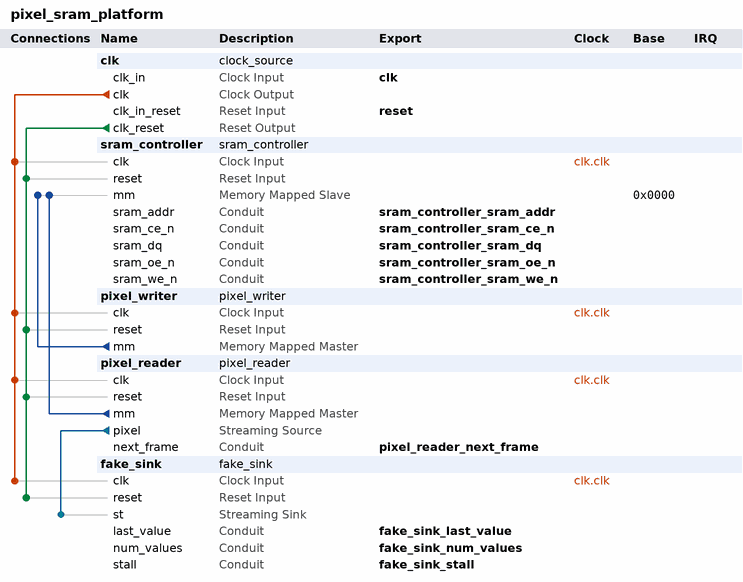
[diagram p0: system contents]
# Platform Designer (Qsys) system pixel_sram_platform, Cyclone IV E EP4CE115F29C7
# Parameters at their usual value, and those the tool derives, are not listed.
package require -exact qsys 21.1
create_system pixel_sram_platform
set_project_property DEVICE_FAMILY {Cyclone IV E}
set_project_property DEVICE EP4CE115F29C7

add_instance clk clock_source 21.1
set_instance_parameter_value clk clockFrequency 50000000

add_instance sram_controller sram_controller 21.1

add_instance pixel_writer pixel_writer 21.1

add_instance pixel_reader pixel_reader 21.1

add_instance fake_sink fake_sink 21.1
set_instance_parameter_value fake_sink COUNTER_WIDTH 8
set_instance_parameter_value fake_sink DATA_WIDTH 24

# connections
add_connection clk.clk fake_sink.clk clock
add_connection clk.clk pixel_reader.clk clock
add_connection clk.clk pixel_writer.clk clock
add_connection clk.clk sram_controller.clk clock
add_connection clk.clk_reset fake_sink.reset reset
add_connection clk.clk_reset pixel_reader.reset reset
add_connection clk.clk_reset pixel_writer.reset reset
add_connection clk.clk_reset sram_controller.reset reset
add_connection pixel_reader.mm sram_controller.mm avalon
set_connection_parameter_value pixel_reader.mm/sram_controller.mm arbitrationPriority 10
set_connection_parameter_value pixel_reader.mm/sram_controller.mm baseAddress 0x0000
add_connection pixel_writer.mm sram_controller.mm avalon
set_connection_parameter_value pixel_writer.mm/sram_controller.mm baseAddress 0x0000
add_connection pixel_reader.pixel fake_sink.st avalon_streaming

# exported interfaces
add_interface clk clock sink
set_interface_property clk EXPORT_OF clk.clk_in
add_interface fake_sink_last_value conduit end
set_interface_property fake_sink_last_value EXPORT_OF fake_sink.last_value
add_interface fake_sink_num_values conduit end
set_interface_property fake_sink_num_values EXPORT_OF fake_sink.num_values
add_interface fake_sink_stall conduit end
set_interface_property fake_sink_stall EXPORT_OF fake_sink.stall
add_interface pixel_reader_next_frame conduit end
set_interface_property pixel_reader_next_frame EXPORT_OF pixel_reader.next_frame
add_interface reset reset sink
set_interface_property reset EXPORT_OF clk.clk_in_reset
add_interface sram_controller_sram_addr conduit end
set_interface_property sram_controller_sram_addr EXPORT_OF sram_controller.sram_addr
add_interface sram_controller_sram_ce_n conduit end
set_interface_property sram_controller_sram_ce_n EXPORT_OF sram_controller.sram_ce_n
add_interface sram_controller_sram_dq conduit end
set_interface_property sram_controller_sram_dq EXPORT_OF sram_controller.sram_dq
add_interface sram_controller_sram_oe_n conduit end
set_interface_property sram_controller_sram_oe_n EXPORT_OF sram_controller.sram_oe_n
add_interface sram_controller_sram_we_n conduit end
set_interface_property sram_controller_sram_we_n EXPORT_OF sram_controller.sram_we_n

set_interconnect_requirement {$system} qsys_mm.clockCrossingAdapter HANDSHAKE
set_interconnect_requirement {$system} qsys_mm.enableEccProtection FALSE
set_interconnect_requirement {$system} qsys_mm.insertDefaultSlave FALSE
set_interconnect_requirement {$system} qsys_mm.maxAdditionalLatency 0
set_interconnect_requirement sram_controller.mm qsys_mm.arbitrationScheme fixed-priority

save_system pixel_sram_platform.qsys
